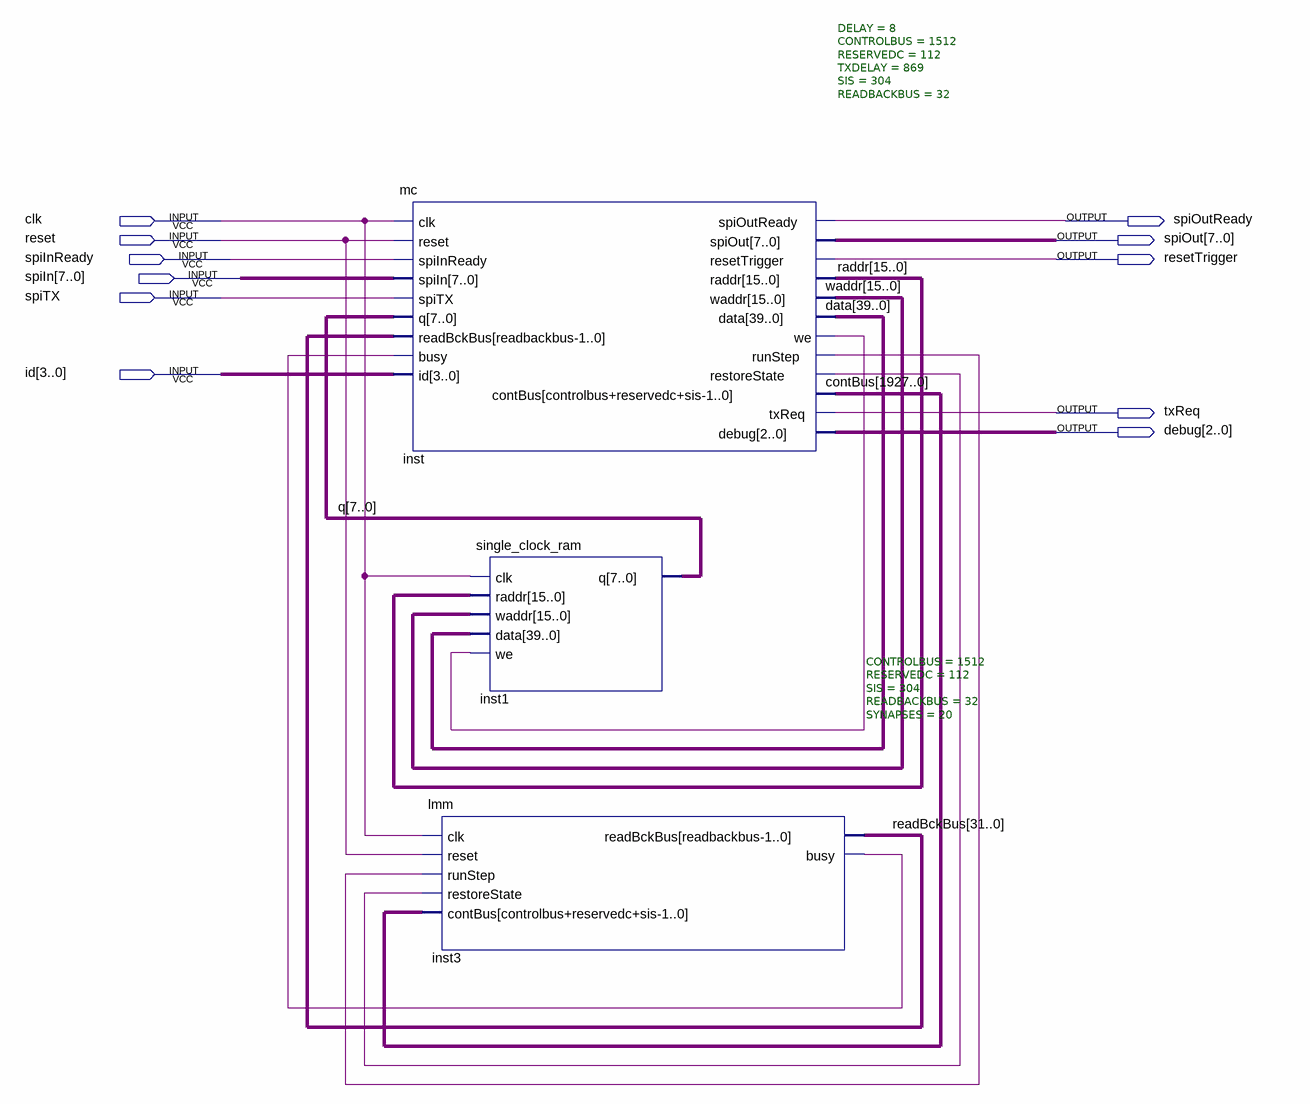
[diagram p0: schematic sheet]
// Quartus schematic muscle.bdf as structural Verilog: 3 symbols, 11 pins
module muscle (
  input  clk,
  input  reset,
  input  spiInReady,
  input  [7:0] spiIn,
  input  spiTX,
  input  [3:0] id,
  output spiOutReady,
  output [7:0] spiOut,
  output resetTrigger,
  output txReq,
  output [2:0] debug
);

  wire inst3_busy, inst_restorestate, inst_runstep, inst_we;
  wire [7:0] q;
  wire [15:0] raddr, waddr;
  wire [31:0] readBckBus;
  wire [39:0] data;
  wire [1927:0] contBus;

  mc #(.DELAY(8), .CONTROLBUS(1512), .RESERVEDC(112), .TXDELAY(869), .SIS(304), .READBACKBUS(32)) inst (
    .clk(clk), .reset(reset), .spiInReady(spiInReady), .spiIn(spiIn), .spiTX(spiTX), .q(q),
    .readBckBus(readBckBus), .busy(inst3_busy), .id(id), .spiOutReady(spiOutReady), .spiOut(spiOut),
    .resetTrigger(resetTrigger), .raddr(raddr), .waddr(waddr), .data(data), .we(inst_we),
    .runStep(inst_runstep), .restoreState(inst_restorestate), .contBus(contBus), .txReq(txReq), .debug(debug));
  single_clock_ram inst1 (.clk(clk), .raddr(raddr), .waddr(waddr), .data(data), .we(inst_we), .q(q));
  lmm #(.CONTROLBUS(1512), .RESERVEDC(112), .SIS(304), .READBACKBUS(32), .SYNAPSES(20)) inst3 (
    .clk(clk), .reset(reset), .runStep(inst_runstep), .restoreState(inst_restorestate), .contBus(contBus),
    .readBckBus(readBckBus), .busy(inst3_busy));
endmodule
